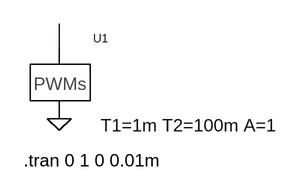
[diagram p0: schematic PWMstest.asc]
PWMstest.asc, the LTspice schematic file:
Version 4
SHEET 1 880 680
WIRE 96 96 96 64
FLAG 96 192 0
SYMBOL pwms 96 144 R0
WINDOW 3 56 1 Left 0
WINDOW 40 56 57 Left 0
SYMATTR Value ""
SYMATTR InstName U1
SYMATTR SpiceLine2 T1=1m T2=100m A=1
TEXT 48 248 Left 0 !.tran 0 1 0 0.01m

The netlist it stands for:
* PWMstest.asc
XU1 N001 0 PWM T1=1m T2=100m A=1  ; pins P N
.tran 0 1 0 0.01m
.lib PWM.sub
.backanno
.end